# Altium project 2013_PerfXBee.PrjPCB
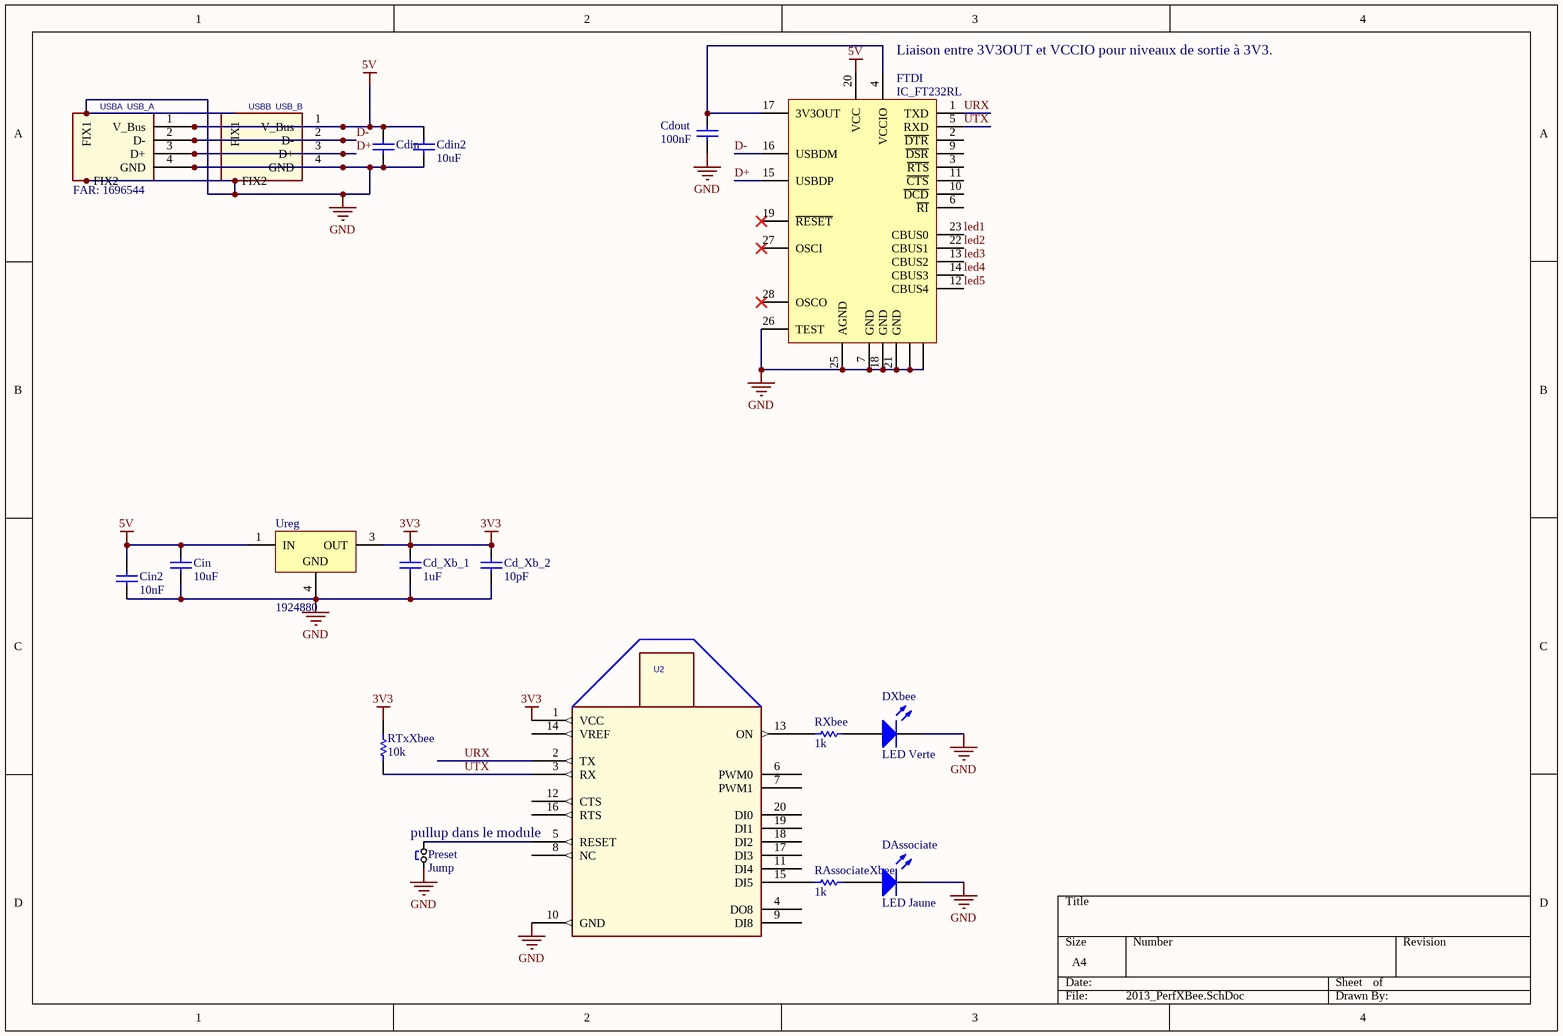
[diagram p0: 2013_PerfXBee.SchDoc]
1 sheet, 18 parts. Net scope: global (net labels, ports and power ports of the same name join across sheets).
Board file: 2013_PerfXBee.PcbDoc

## Sheet 2013_PerfXBee.SchDoc
size A4

### Parts
Cd_Xb_1  1uF  [C0805_N]
Cd_Xb_2  10pF  [C0805_N]
Cdin  100nF  [C0603_N]  (value not drawn)
Cdin2  10uF  [C1206_N]
Cdout  100nF  [C0603_N]
Cin  10uF  [C1206_N]
Cin2  10nF  [C0805_N]
DAssociate  LED Jaune  [LED_0805]
DXbee  LED Verte  [LED_0805]
FTDI  IC_FT232RL  [SSOP28_N]
Preset  Jump  [HDR1X2]
RAssociateXbee  1k  [R1206_N]
RTxXbee  10k  [R1206_N]
RXbee  1k  [R1206_N]
U2  XBee  [MODULE_XBEE]  (value not drawn)
Ureg  1924880  [369A-13]
USBA  USB_A  FAR: 1696544  [USB_A_COUDE - FAR1696544]
USBB  USB_B  [USB_B_COUDE]

### Nets
3V3: Cd_Xb_1.2 Cd_Xb_2.2 RTxXbee.1 U2.1(VCC) Ureg.3(OUT)
5V: Cdin.2 Cdin2.2 Cin.2 Cin2.2 FTDI.20(VCC) Ureg.1(IN) USBA.1(V_Bus) USBB.1(V_Bus)
GND: Cd_Xb_1.1 Cd_Xb_2.1 Cdin.1 Cdin2.1 Cdout.1 Cin.1 Cin2.1 DAssociate.2(K) DXbee.2(K) FTDI.7(GND) FTDI.8(NC) FTDI.18(GND) FTDI.21(GND) FTDI.24(NC) FTDI.25(AGND) FTDI.26(TEST) Preset.1 U2.10(GND) Ureg.4(GND) USBA.4(GND) USBA.FIX1 USBA.FIX2 USBB.4(GND) USBB.FIX1 USBB.FIX2
D+: FTDI.15(USBDP) USBA.3(D+) USBB.3(D+)
D-: FTDI.16(USBDM) USBA.2(D-) USBB.2(D-)
led1: FTDI.23(CBUS0)
led2: FTDI.22(CBUS1)
led3: FTDI.13(CBUS2)
led4: FTDI.14(CBUS3)
led5: FTDI.12(CBUS4)
URX: FTDI.1(TXD) U2.2(TX)
UTX: FTDI.5(RXD) RTxXbee.2 U2.3(RX)
NetCdout_2: Cdout.2 FTDI.4(VCCIO) FTDI.17(3V3OUT)
NetDAssociate_1: DAssociate.1(A) RAssociateXbee.2
NetDXbee_1: DXbee.1(A) RXbee.2
NetPreset_2: Preset.2 U2.5(RESET)
NetRAssociateXbee_1: RAssociateXbee.1 U2.15(DI5)
NetRXbee_1: RXbee.1 U2.13(ON)

Not connected (* = marked no-connect by the designer): FTDI 2(~{DTR}) 3(~{RTS}) 6(~{RI}) 9(~{DSR}) 10(~{DCD}) 11(~{CTS}) 19(~{RESET})* 27(OSCI)* 28(OSCO)*; U2 4(DO8) 6(PWM0) 7(PWM1) 8(NC) 9(DI8) 11(DI4) 12(CTS) 14(VREF) 16(RTS) 17(DI3) 18(DI2) 19(DI1) 20(DI0)

### Notes on the sheet
- (near FTDI) Liaison entre 3V3OUT et VCCIO pour niveaux de sortie à 3V3.
- pullup dans le module

### Library data of the parts
Cd_Xb_1 Cd_Xb_2 = Condensateur: Capacitor; Published: 8-Jun-2000; LatestRevisionDate: 17-Jul-2002; LatestRevisionNote: Re-released for DXP Platform.; PackageReference: RAD-0.3; Publisher: Altium Limited
Cdin Cdout = Capacitor: FAR: 1740614; Published: 01/01/10; LatestRevisionDate: 17-Jul-2002; LatestRevisionNote: Re-released for DXP Platform.; Publisher: Damien GUITTON
Cdin2 Cin Cin2 = Capacitor: Published: 8-Jun-2000; LatestRevisionDate: 17-Jul-2002; LatestRevisionNote: Re-released for DXP Platform.; PackageReference: RAD-0.3; Publisher: Altium Limited
DAssociate DXbee = LED: Typical LED; Published: 8-Jun-2000; LatestRevisionDate: 08-Jul-2005; LatestRevisionNote: Mech Layer 1 removed.; PackageReference: LED-1; Publisher: Altium Limited
FTDI = IC_FT232RL: FT232R USB UART; Manufacturer: *; Note: *; ManufacturerPartNo: *
Preset = Jumper SIP2.54
RAssociateXbee RTxXbee RXbee = Resistor: Published: 8-Jun-2000; LatestRevisionDate: 17-Jul-2002; LatestRevisionNote: Re-released for DXP Platform.; PackageReference: AXIAL-0.5; Publisher: Altium Limited
Ureg = MC7805ACD2T: Three-Terminal Positive Voltage Regulator; Note: Pin 2 is electrically connected to Pin 4; Pin 2 is trimmed and not drawn;; Published: 15-Apr-2002; DatasheetVersion: 1997; PackageVersion: 1997; PackageReference: 936-03; Publisher: Altium Limited; PackageDescription: D2-PAK/TO-263-AB; 3 Leads (1 Cropped); Body 14.7 (inc. leads) x 10.2 mm (LxW max); ComponentLink1Description: Manufacturer Link; ComponentLink1URL: http://www.onsemi.com/site/products/taxonomy/0,4438,503,00.html; ComponentLink2Description: Datasheet; ComponentLink2URL: http://www.onsemi.com/pub/Collateral/MC7800-D.PDF
USBA = USB_B: FAR1696544